# EAGLE design slider (EAGLE 9.5.2)
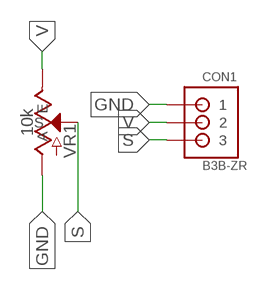
[diagram p0: schematic, sheet 1]

## Parts
CON1  B3B-ZR  [B3B-ZR]
VR1  10k  POTENTIOMETER_SLIDE-30MM-1/10W-20%-KIT  [SLIDER-MEDIUM-KIT]

## Nets
GND: CON1.1 VR1.MINUS(A)
S: CON1.3 VR1.WIPER2(S) VR1.WIPER(S)
V: CON1.2 VR1.PLUS(E)

## Library data of the parts
CON1 = jst:B3B-ZR: JST-ZH Connector 3 pol, 1.5mm pitch Package: B3B-ZR Source: http://www.jst-mfg.com/product/pdf/eng/eZH.pdf
VR1 = vince:POTENTIOMETER_SLIDE: Slide Potentiometer Slide-type potentiometers - pots that are adjusted by sliding a wiper up or down. Commonly found en-masse on sound boards. Variants 60MM - Slide Pot - X-Large (10k Linear Taper) <https://www.sparkfun.com/products/9119> (COM-09119) 10k linear slide pot with 60mm travel. Datasheet <http://cdn.sparkfun.com/datasheets/Components/Switches/SC608N-b10k.pdf> 30MM, 30MM-KIT - Slide Pot - Medium (10k Linear Taper) <https://www.sparkfun.com/products/11621> (COM-11621) 10k linear slide pot with 30mm travel. Datasheet <http://cdn.sparkfun.com/datasheets/Components/Switches/C-31-.pdf> (C3031N-1A2-B10K-GP) "KIT" variant, intended for soldering kits, has tStop removed from pads so the component can only be stuffed on one side of the board. 20MM - Slide Pot - Small (10k Linear Taper) <https://www.sparkfun.com/products/11620> (COM-11620) 10k linear slide pot with 20mm travel. Datasheet <http://cdn.sparkfun.com/datasheets/Components/Switches/C-31-.pdf> (C2031N-1A2-B10K-GP); PROD_ID: RES-11931; SF_SKU: COM-11621

## Board
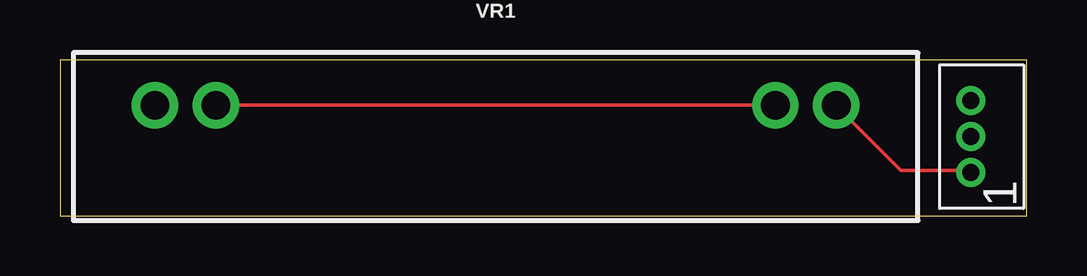
[diagram p1: board, top side]
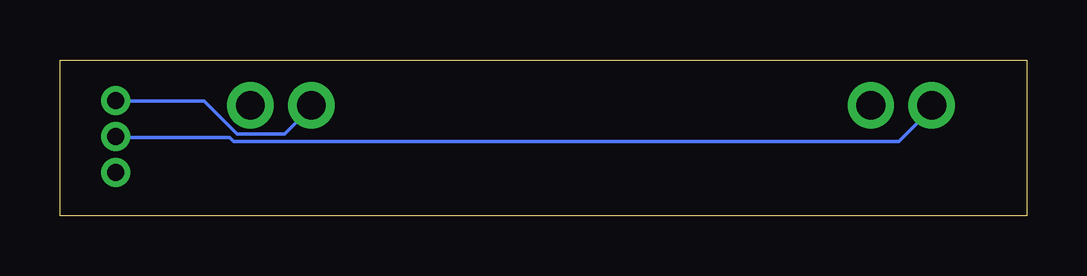
[diagram p2: board, bottom side, seen from below]

Size 40.3 x 6.5 mm. Coordinates in mm from the lower left corner, seen from the top.
Outline: 0,0 40.3,0 40.3,6.5 0,6.5 0,0
Copper layers (1*16): Top 0.035mm / dielectric 1.5mm / Bottom 0.035mm
Design rules "default": minimum track width 6mil, minimum drill 0.35mm, track to track 6mil, track to pad 6mil, pad to pad 6mil, via to via 6mil, smd to smd 6mil, copper to edge 40mil, drill to drill 6mil, minimum pad ring 10mil, minimum via ring 8mil, stop-mask expansion 4mil, vias tented up to drill 0mil, thermal gap 10mil

### Footprints (pad centres in the part's own frame; a part is rotated, then mirrored left to right if it is on the bottom)
B3B-ZR = drill 0.7 pad 1.1: 1 -1.5,0; 2 0,0; 3 1.5,0
SLIDER-MEDIUM-KIT = drill 1.2 pad 1.93: MINUS 14.2,1.3; PLUS -14.2,1.3; WIPER -11.66,1.3; WIPER2 11.66,1.3

### Placement (x,y rotation side)
CON1  37.97,3.3 90 top
VR1  18.16,3.3 0 top

### Tracks (layer width: path | path; a pad name or v marks a point on that pad's centre or on a via)
GND
  Top 0.152: CON1.1 37.95,1.88 35.05,1.88 32.46,4.47 VR1.MINUS
S
  Top 0.152: VR1.WIPER 6.55,4.62 29.72,4.62 VR1.WIPER2
  Bottom 0.152: CON1.3 37.95,4.77 34.29,4.77 32.92,3.4 30.94,3.4 29.87,4.47 VR1.WIPER2
V
  Bottom 0.152: CON1.2 37.95,3.25 33.22,3.25 33.07,3.1 5.33,3.1 3.96,4.47 VR1.PLUS

### Text on the board
tNames: 1